# EAGLE design Shutdown Circuit (EAGLE 8.6.2)
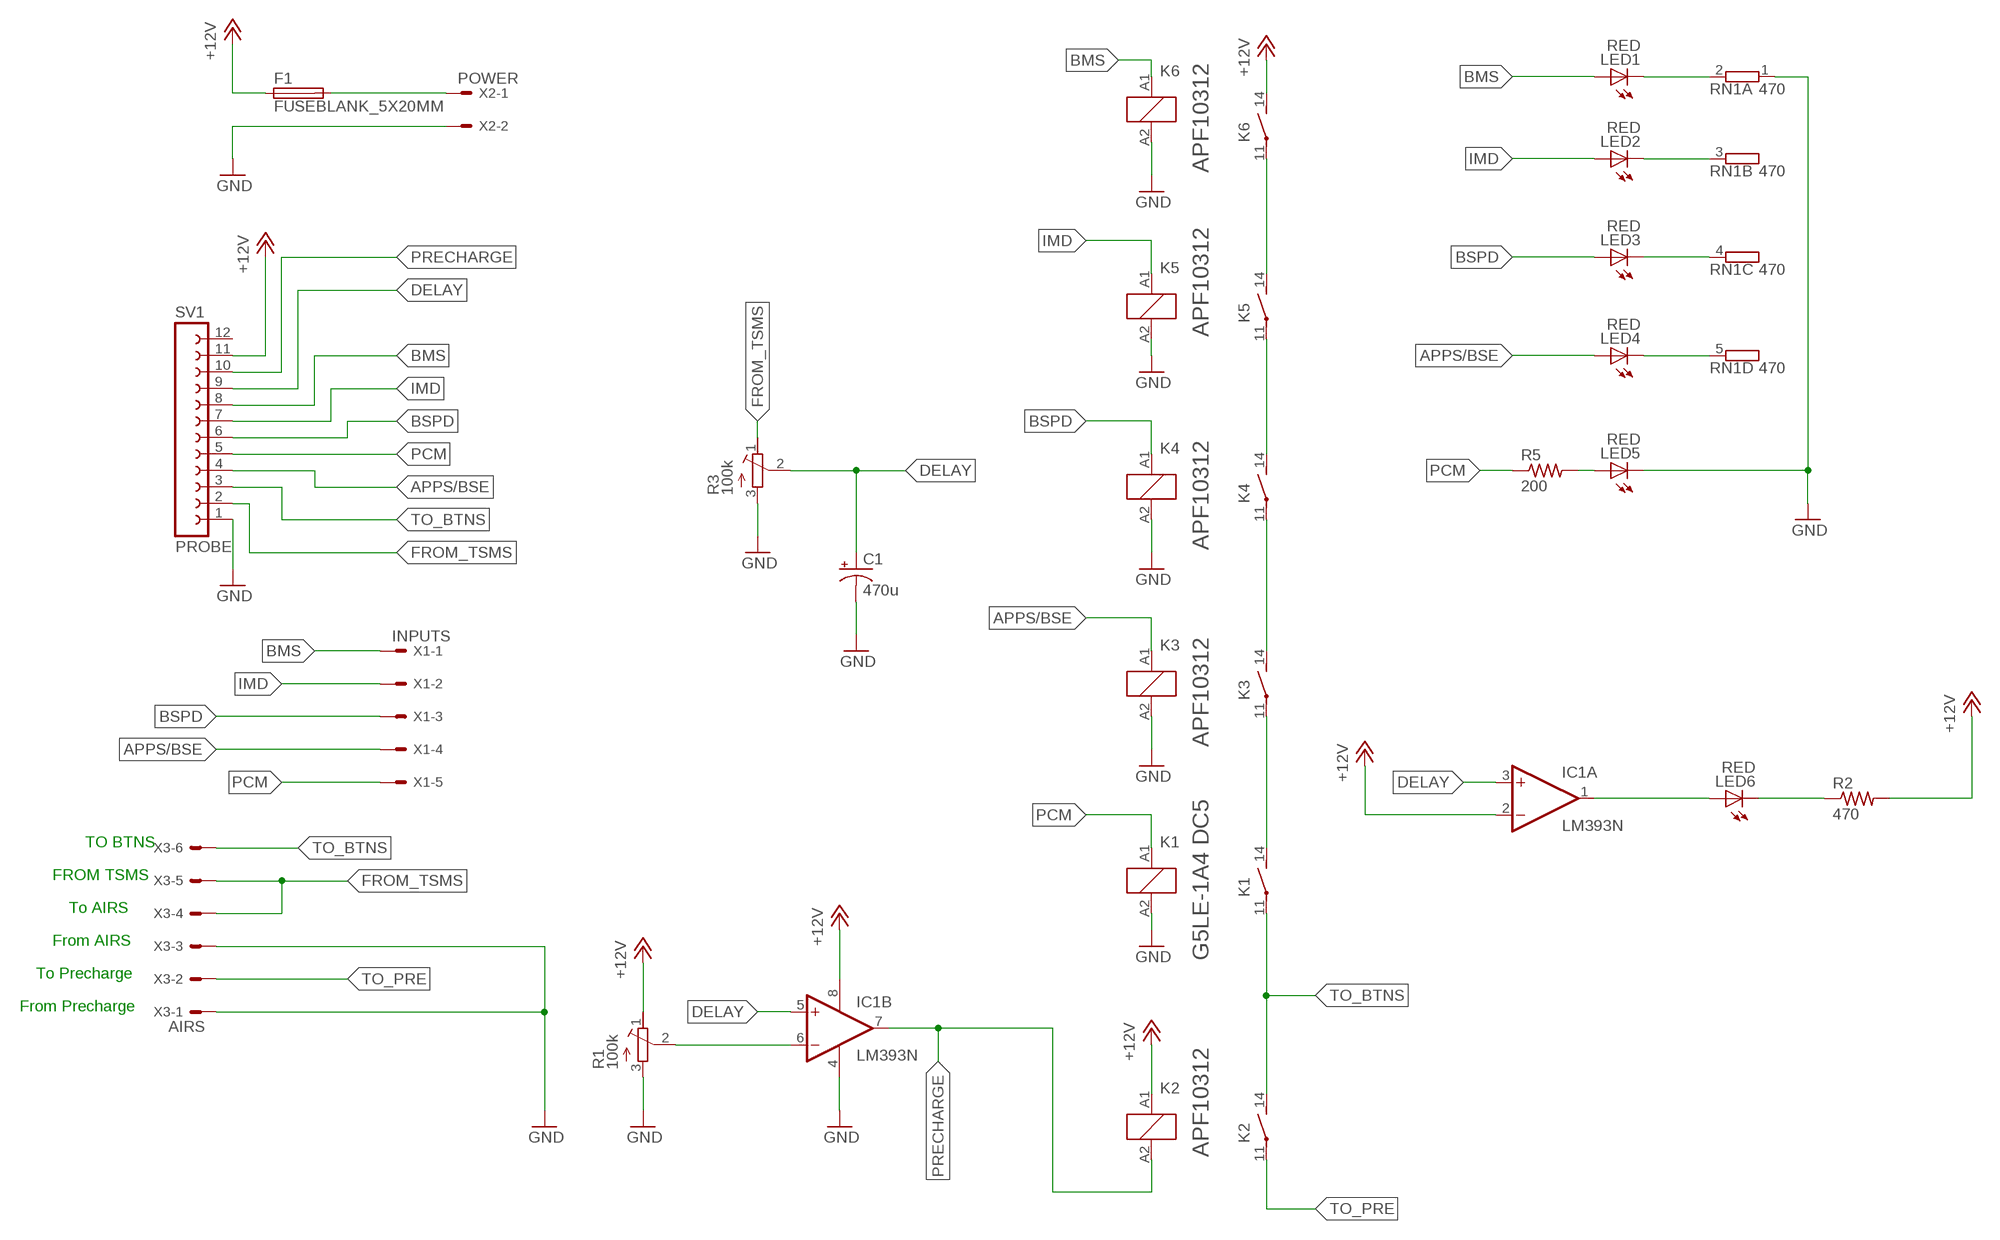
[diagram p0: schematic, sheet 1]

## Parts
C1  470u  CPOL-USE3.5-10  [E3,5-10]
F1  FUSEBLANK_5X20MM  [FUSE_HOLDER_5X20MM]
IC1  LM393N  [DIL08]
K1  G5LE-1A4 DC5  ZNS1106  [ZN1]
K2  APF10312  SNR1  [SNR-V1]
K3  APF10312  SNR1  [SNR-V1]
K4  APF10312  SNR1  [SNR-V1]
K5  APF10312  SNR1  [SNR-V1]
K6  APF10312  SNR1  [SNR-V1]
LED1  RED  LED5MM  [LED5MM]
LED2  RED  LED5MM  [LED5MM]
LED3  RED  LED5MM  [LED5MM]
LED4  RED  LED5MM  [LED5MM]
LED5  RED  LED5MM  [LED5MM]
LED6  RED  LED5MM  [LED5MM]
R1  100k  R-TRIMM3006P  [RTRIM3006P]
R2  470  R-US_0207/10  [0207/10]
R3  100k  R-TRIMM3006P  [RTRIM3006P]
R5  200  R-US_0207/10  [0207/10]
RN1  470  GE04R  [SIL5]
SV1  PROBE  FE12W  [FE12W]
X1  INPUTS  22-23-2051  [22-23-2051]
X2  POWER  22-23-2021  [22-23-2021]
X3  AIRS  22-23-2061  [22-23-2061]

## Nets
+12V: F1.1 IC1.2(A:-IN) IC1.8(P:V+) K2.A1 K6.14(2:S) R1.1(E) R2.2 SV1.11
APPS/BSE: K3.A1 LED4.A SV1.4 X1.4
BMS: K6.A1 LED1.A SV1.8 X1.1
BSPD: K4.A1 LED3.A SV1.6 X1.3
DELAY: C1.+ IC1.3(A:+IN) IC1.5(B:+IN) R3.2(S) SV1.9
FROM_TSMS: R3.1(E) SV1.2 X3.4 X3.5
GND: C1.- IC1.4(P:V-) K1.A2 K3.A2 K4.A2 K5.A2 K6.A2 LED5.K(C) R1.3(A) R3.3(A) RN1.1 SV1.1 X2.2 X3.1 X3.3
IMD: K5.A1 LED2.A SV1.7 X1.2
N$1: F1.2 X2.1
N$2: LED5.A R5.2
N$3: LED4.K(C) RN1.5
N$4: LED3.K(C) RN1.4
N$5: IC1.6(B:-IN) R1.2(S)
N$6: LED1.K(C) RN1.2
N$7: IC1.1(A:OUT) LED6.A
N$8: LED2.K(C) RN1.3
N$10: K5.14(2:S) K6.11(2:P)
N$13: LED6.K(C) R2.1
N$17: K4.14(2:S) K5.11(2:P)
N$18: K3.14(2:S) K4.11(2:P)
N$19: K1.14(2:S) K3.11(2:P)
PCM: K1.A1 R5.1 SV1.5 X1.5
PRECHARGE: IC1.7(B:OUT) K2.A2 SV1.10
TO_BTNS: K1.11(2:P) K2.14(2:S) SV1.3 X3.6
TO_PRE: K2.11(2:P) X3.2
Unconnected: SV1.12

## Notes on the sheet
- TO BTNS
- FROM TSMS
- To AIRS
- From AIRS
- To Precharge
- From Precharge

## Library data of the parts
C1 = rcl:CPOL-US: POLARIZED CAPACITOR, American symbol; SPICEPREFIX: C
F1 = fuse:FUSE: Fuse; OC_FARNELL: unknown; OC_NEWARK: unknown
IC1 = linear:LM393: COMPARATOR
K1 = relay:ZNS1*: Miniature Power PCB Relay SCHRACK 1pole 10 A Source: http://www.schrack.com/.. 5847.pdf; OC_FARNELL: unknown; OC_NEWARK: unknown
K2-K6 = relay:SN*: Slim PCB Relay 1 pole 6 A SCHRACK Source: http://www.schrack.com/.. 5815.pdf; OC_FARNELL: unknown; OC_NEWARK: unknown
LED1-LED6 = led:LED: LED OSRAM: - CHIPLED LG R971, LG N971, LY N971, LG Q971, LY Q971, LO R971, LY R971 LH N974, LH R974 LS Q976, LO Q976, LY Q976 LO Q996 - Hyper CHIPLED LW Q18S LB Q993, LB Q99A, LB R99A - SideLED LS A670, LO A670, LY A670, LG A670, LP A670 LB A673, LV A673, LT A673, LW A673 LH A674 LY A675 LS A676, LA A676, LO A676, LY A676, LW A676 LS A679, LY A679, LG A679 - Hyper Micro SIDELED® LS Y876, LA Y876, LO Y876, LY Y876 LT Y87S - SmartLED LW L88C, LW L88S LB L89C, LB L89S, LG L890 LS L89K, LO L89K, LY L89K LS L896, LA L896, LO L896, LY L896 - TOPLED LS T670, LO T670, LY T670, LG T670, LP T670 LSG T670, LSP T670, LSY T670, LOP T670, LYG T670 LG T671, LOG T671, LSG T671 LB T673, LV T673, LT T673, LW T673 LH T674 LS T676, LA T676, LO T676, LY T676, LB T676, LH T676, LSB T676, LW T676 LB T67C, LV T67C, LT T67C, LS T67K, LO T67K, LY T67K, LW E67C LS E67B, LA E67B, LO E67B, LY E67B, LB E67C, LV E67C, LT E67C LW T67C LS T679, LY T679, LG T679 LS T770, LO T770, LY T770, LG T770, LP T770 LB T773, LV T773, LT T773, LW T773 LH T774 LS E675, LA E675, LY E675, LS T675 LS T776, LA T776, LO T776, LY T776, LB T776 LHGB T686 LT T68C, LB T68C - Hyper Mini TOPLED® LB M676 - Mini TOPLED Santana® LG M470 LS M47K, LO M47K, LY M47K Source: http://www.osram.convergy.de LUXEON: - LUMILED® LXK2-PW12-R00, LXK2-PW12-S00, LXK2-PW14-U00, LXK2-PW14-V00 LXK2-PM12-R00, LXK2-PM12-S00, LXK2-PM14-U00 LXK2-PE12-Q00, LXK2-PE12-R00, LXK2-PE12-S00, LXK2-PE14-T00, LXK2-PE14-U00 LXK2-PB12-K00, LXK2-PB12-L00, LXK2-PB12-M00, LXK2-PB14-N00, LXK2-PB14-P00, LXK2-PB14-Q00 LXK2-PR12-L00, LXK2-PR12-M00, LXK2-PR14-Q00, LXK2-PR14-R00 LXK2-PD12-Q00, LXK2-PD12-R00, LXK2-PD12-S00 LXK2-PH12-R00, LXK2-PH12-S00 LXK2-PL12-P00, LXK2-PL12-Q00, LXK2-PL12-R00 Source: www.luxeon.com KINGBRIGHT: KA-3528ASYC Source: www.kingbright.com
R1 R3 = rcl:R-TRIMM: Trimm resistor; SPICEMODEL: X; SPICEPREFIXL: POT
R2 R5 = rcl:R-US_: RESISTOR, American symbol; SPICEPREFIX: R
RN1 = resistor-sil:GE04R: SIL RESISTOR; OC_FARNELL: unknown; OC_NEWARK: unknown
SV1 = con-lsta:FE12W: FEMALE HEADER; OC_FARNELL: unknown; OC_NEWARK: unknown
X1 = con-molex:22-23-2051: .100" (2.54mm) Center Header - 5 Pin; MF: MOLEX; MPN: 22-23-2051; OC_FARNELL: 1462952; OC_NEWARK: 38C9178
X2 = con-molex:22-23-2021: .100" (2.54mm) Center Header - 2 Pin; MF: MOLEX; MPN: 22-23-2021; OC_FARNELL: 1462926; OC_NEWARK: 25C3832
X3 = con-molex:22-23-2061: .100" (2.54mm) Center Header - 6 Pin; MF: MOLEX; MPN: 22-23-2061; OC_FARNELL: 1462922; OC_NEWARK: 27C1933

## Board
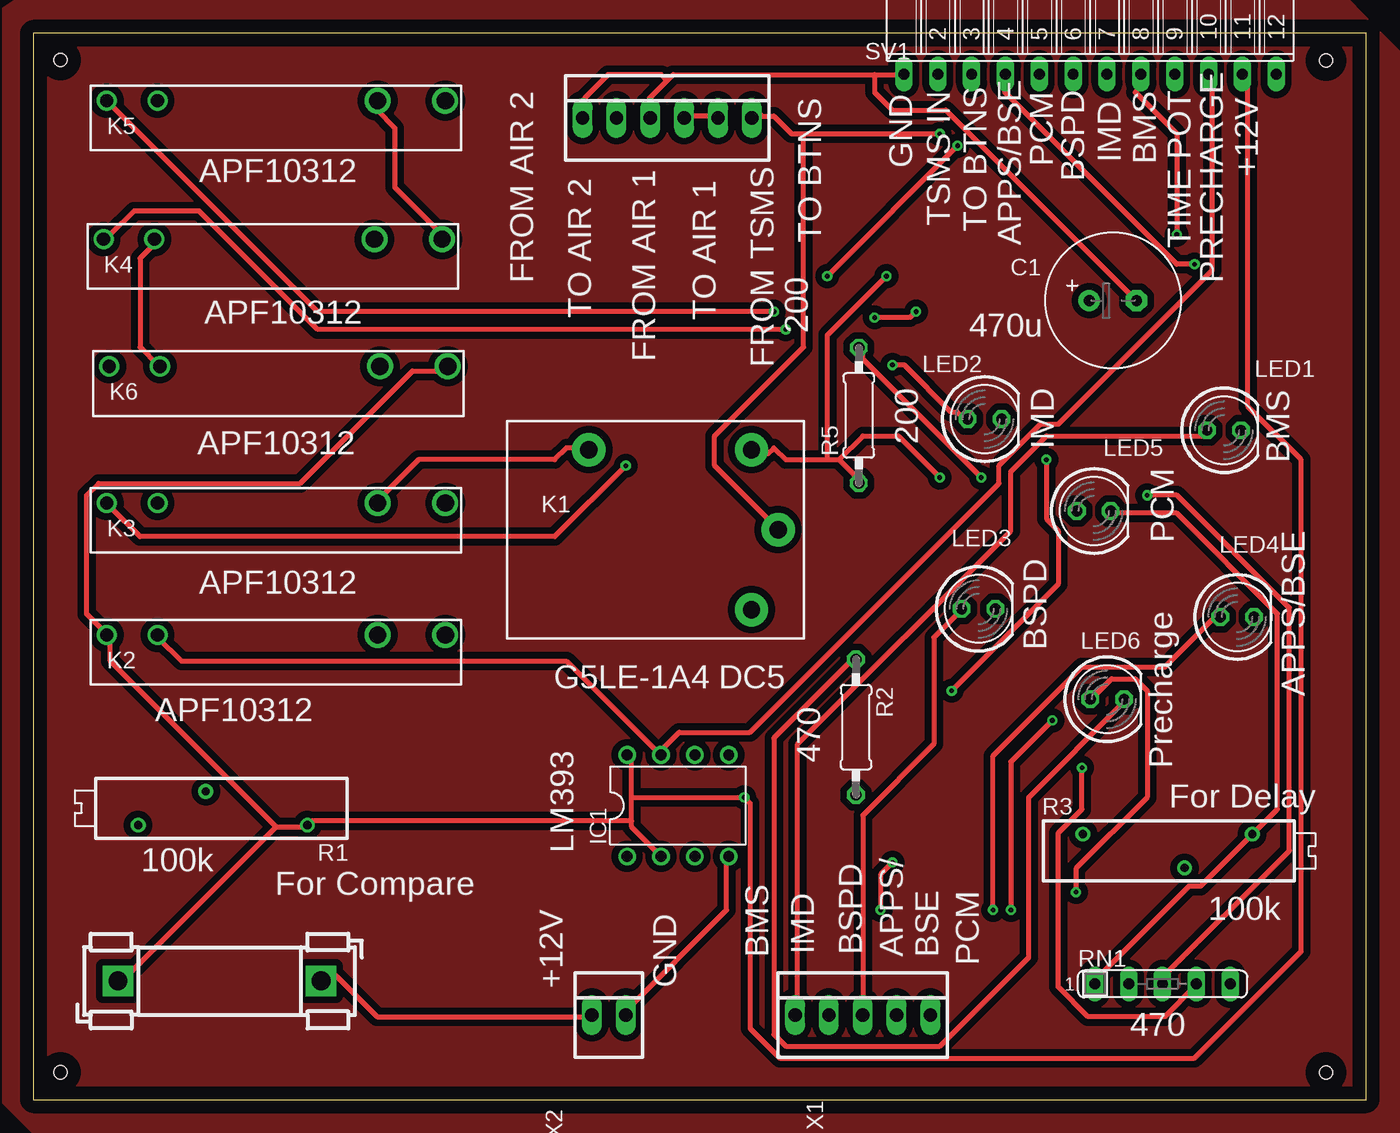
[diagram p1: board, top side]
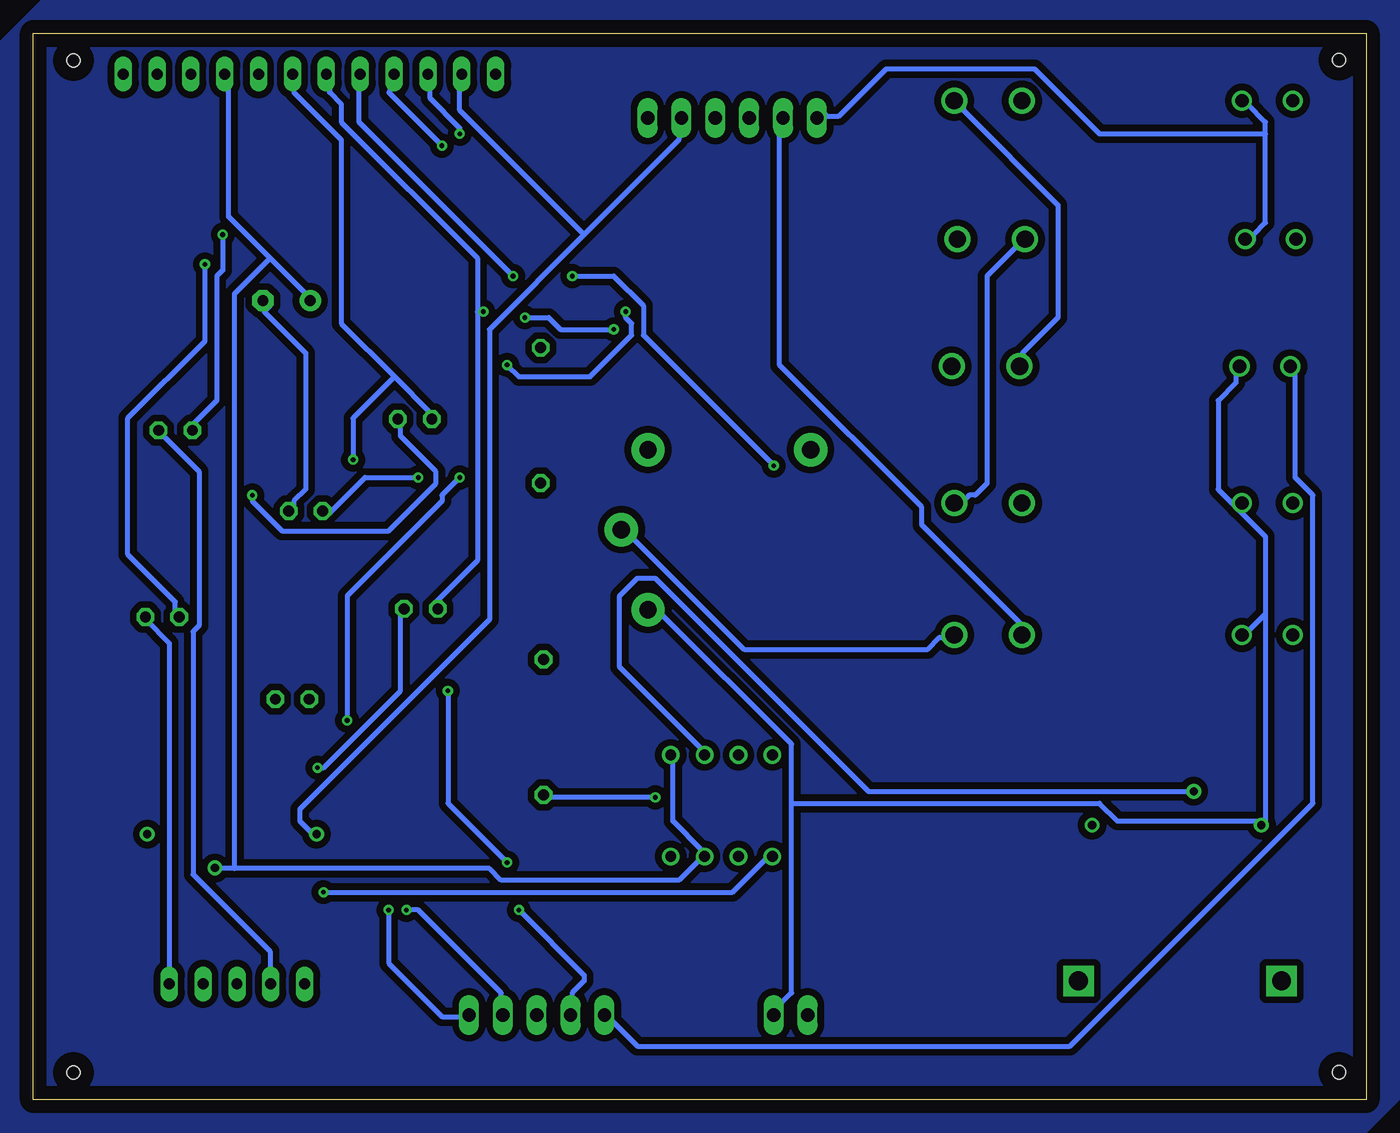
[diagram p2: board, bottom side, seen from below]

Size 100 x 80 mm. Coordinates in mm from the lower left corner, seen from the top.
Outline: 0,0 100,0 100,80 0,80 0,0
Copper layers (1*16): Top 0.035mm / dielectric 1.5mm / Bottom 0.035mm
Design rules "default *": minimum track width 15mil, minimum drill 0.35mm, track to track 20mil, track to pad 20mil, pad to pad 20mil, via to via 20mil, smd to smd 6mil, copper to edge 40mil, drill to drill 6mil, minimum pad ring 10mil, minimum via ring 8mil, stop-mask expansion 4mil, vias tented up to drill 0mil, thermal gap 10mil
Holes 1 mm at 2.04,77.99 96.98,77.97 2.04,2.04 96.98,2.03

### Footprints (pad centres in the part's own frame; a part is rotated, then mirrored left to right if it is on the bottom)
E3,5-10 = drill 0.813 pad 1.6: + -1.778,0 | drill 0.813 pad 1.6 octagon: - 1.778,0
FUSE_HOLDER_5X20MM = drill 1.422 pad 2.286 square: 1 0,0; 2 15.24,0
DIL08 = drill 0.813 pad 1.27: 1 -3.81,-3.81; 2 -1.27,-3.81; 3 1.27,-3.81; 4 3.81,-3.81; 5 3.81,3.81; 6 1.27,3.81; 7 -1.27,3.81; 8 -3.81,3.81
ZN1 = drill 1.3 pad 2.5: 11 8.89,0; 14 -5.31,6; A1 6.89,6; A2 6.89,-6
SNR-V1 = drill 1.3: 11 7.62,1.27; 14 12.7,1.27 | drill 1: A1 -12.7,1.27; A2 -8.89,1.27
LED5MM = drill 0.813 octagon: A -1.27,0; K 1.27,0
RTRIM3006P = drill 0.61: 1 -7.62,1.27; 2 0,-1.27; 3 5.08,1.27
0207/10 = drill 0.813 octagon: 1 -5.08,0; 2 5.08,0
SIL5 = drill 0.813 long: 1 -5.08,0; 2 -2.54,0; 3 0,0; 4 2.54,0; 5 5.08,0
FE12W = drill 0.813 long: 1 -13.97,0; 2 -11.43,0; 3 -8.89,0; 4 -6.35,0; 5 -3.81,0; 6 -1.27,0; 7 1.27,0; 8 3.81,0; 9 6.35,0; 10 8.89,0; 11 11.43,0; 12 13.97,0
22-23-2051 = drill 1 long: 1 -5.08,0; 2 -2.54,0; 3 0,0; 4 2.54,0; 5 5.08,0
22-23-2021 = drill 1 long: 1 -1.27,0; 2 1.27,0
22-23-2061 = drill 1 long: 1 -6.35,0; 2 -3.81,0; 3 -1.27,0; 4 1.27,0; 5 3.81,0; 6 6.35,0

### Placement (x,y rotation side)
C1  81,59.94 0 top
F1  6.35,8.89 0 top
IC1  48.36,22.05 0 top
K1  46.99,42.76 0 top
K2  18.21,33.59 0 top
K3  18.21,43.48 0 top
K4  17.97,63.28 0 top
K5  18.21,73.67 0 top
K6  18.39,53.75 0 top
LED1  89.33,50.22 0 top
LED2  71.37,51.05 0 top
LED3  70.92,36.82 0 top
LED4  90.32,36.21 0 top
LED5  79.57,44.16 0 top
LED6  80.57,30.04 0 top
R1  12.94,21.86 180 top
R2  61.72,27.94 270 top
R3  86.37,18.64 0 top
R5  61.94,51.33 90 top
RN1  84.72,8.67 0 top
SV1  79.29,76.94 0 top
X1  62.23,6.35 0 top
X2  43.18,6.35 0 top
X3  47.56,73.66 0 top

### Tracks (layer width: path | path; a pad name or v marks a point on that pad's centre or on a via)
+12V  (via drill 0.35)
  Top 0.381: 18.22,20.45 20.45,20.45 R1.1 20.89,20.89 44.9,20.89 | 18.22,20.45 6.67,8.89 F1.1 | 18.22,20.45 5.78,32.89 5.78,34.67 K2.A1 5.33,35.12 4,36.45 4,45.34 4.89,46.23 20,46.23 28.45,54.67 30.67,54.67 K6.14 | 44.9,20.89 44.9,20.45 46.67,18.67 IC1.2 | 44.9,20.89 44.9,22.67 | 44.9,22.67 44.9,25.78 IC1.8 | 44.9,22.67 v53.34,22.67 53.78,22.23 53.78,5.33 56.01,3.11 87.12,3.11 95.12,11.11 95.12,48.01 91.12,52.01 91.12,76.9 SV1.11
  Bottom 0.381: v53.34,22.67 61.34,22.67 R2.2
APPS/BSE  (via drill 0.35)
  Top 0.381: v72.01,14.22 72.01,25.78 78.68,32.45 84.9,32.45 88.46,36.01 88.9,36.01 LED4.A | v87.12,62.67 85.79,62.67 72.9,75.56 72.9,76.9 SV1.4 | v44.45,47.56 39.12,42.23 8,42.23 5.78,44.45 K3.A1 | v69.34,71.56 v59.56,61.78
  Bottom 0.381: v72.01,14.22 71.12,14.22 64.9,8 64.9,6.67 X1.4 | v87.12,62.67 87.12,56.9 92.9,51.12 92.9,40.89 89.34,37.34 89.34,36.45 LED4.A | v44.45,47.56 54.23,57.34 54.23,59.56 56.45,61.78 v59.56,61.78 | v69.34,71.56 73.34,75.56 72.9,76.01 72.9,76.9 SV1.4
BMS  (via drill 0.35)
  Top 0.381: v85.79,64.9 85.79,72.45 82.68,75.56 83.12,76.01 83.12,76.9 SV1.8 | LED1.A 88.01,49.78 76.01,49.78 73.34,47.12 73.34,42.67 57.34,26.67 57.34,6.67 X1.1
  Bottom 0.381: v85.79,64.9 85.79,62.23 86.23,61.78 86.23,52.45 88.01,50.67 88.01,50.23 LED1.A | K6.A1 5.33,54.67 5.33,46.67 4,45.34 4,22.23 22.23,4 54.67,4 56.9,6.22 X1.1
BSPD  (via drill 0.35)
  Top 0.381: v56.45,57.78 21.34,57.78 12.45,66.67 7.56,66.67 5.78,64.9 5.33,64.9 K4.A1 | v63.12,58.67 65.79,58.67 v66.23,59.12 | X1.3 62.23,21.34 67.56,26.67 67.56,34.67 69.34,36.45 LED3.A
  Bottom 0.381: 66.67,59.12 66.67,63.12 76.9,73.34 76.9,74.68 77.79,75.56 77.79,76.9 SV1.6 | 66.67,59.12 66.67,40.45 69.79,37.34 69.79,36.89 LED3.A | v56.45,57.78 60.45,57.78 61.34,58.67 v63.12,58.67 | 66.67,59.12 v66.23,59.12
DELAY
  Bottom 0.381: 82.23,63.12 79.12,60.01 C1.+ | 82.23,63.12 85.34,66.23 85.34,76.9 SV1.9 | 84.9,17.34 65.79,17.34 64.9,16.45 51.56,16.45 49.78,18.22 IC1.3 49.78,18.67 52.01,20.89 52.01,25.78 IC1.5 | 84.9,17.34 86.23,17.34 R3.2 | 82.23,63.12 84.9,60.45 84.9,17.34
FROM_TSMS
  Top 0.381: X3.4 48.9,73.79 51.12,73.79 X3.5
  Bottom 0.381: 58.67,64.9 51.56,72.01 51.56,73.34 X3.5 | 58.67,64.9 65.79,57.78 65.79,36.01 80.01,21.78 80.01,20.89 79.12,20 R3.1 | 58.67,64.9 68.01,74.23 68.01,76.9 SV1.2
GND
  Top 0.381: K6.A2 9.34,55.12 8,56.45 8,63.12 9.34,64.45 K4.A2 | 63.12,76.9 48.01,76.9 47.56,76.45 | 63.12,76.9 64.9,76.9 SV1.1 | 47.56,76.45 46.23,75.12 46.23,73.79 X3.3 | 47.56,76.45 47.12,76.9 43.12,76.9 41.34,75.12 41.34,73.79 X3.1 | 63.12,76.9 63.12,75.56 64.45,74.23 68.45,74.23 82.68,60.01 C1.- | IC1.4 52.01,18.22 52.01,14.22 44.45,6.67 X2.2 | LED5.K 80.9,44.01 85.79,44.01 93.34,36.45 93.34,21.78 91.57,20 R3.3 91.12,19.56 87.57,16 86.68,16 80.01,9.34 80.01,8.89 RN1.1
  Bottom 0.381: 7.56,36.45 8.89,35.12 | 7.56,36.45 7.56,42.23 9.78,44.45 | 9.78,44.45 9.34,44.9 K3.A2 9.78,44.45 | 7.56,72.45 7.56,65.79 8.45,64.9 8.45,64.45 8.89,64.01 9.34,64.45 K4.A2 | 7.56,72.45 7.56,73.34 8.89,74.68 K5.A2 | 9.78,44.45 11.11,45.78 11.11,52.45 9.78,53.78 9.78,54.67 K6.A2 | LED5.K 80.45,44.45 80.45,44.9 79.57,45.78 79.57,56.01 82.68,59.12 82.23,59.56 82.23,60.01 82.68,60.01 C1.- | 7.56,72.45 20,72.45 24.89,77.34 36.01,77.34 39.56,73.79 40.45,73.79 40.89,74.23 41.34,73.79 X3.1 | 43.12,22.23 43.12,8 44.45,6.67 X2.2 | 43.12,22.23 43.12,26.67 52.9,36.45 53.78,36.45 K1.A2 | 7.56,36.45 7.56,20.89 R1.3 8,20.89 18.67,20.89 20,22.23 43.12,22.23
IMD  (via drill 0.35)
  Top 0.381: v63.56,14.22 63.56,16.89 v64.45,17.78 | v68.9,30.67 76.9,38.67 76.9,42.67 76.01,43.56 v76.01,48.01 | K5.A1 21.34,59.12 v55.56,59.12 | v64.45,55.12 65.34,55.12 68.9,51.56 69.34,51.56 69.79,51.12 LED2.A
  Bottom 0.381: 72.9,54.23 76.9,58.23 76.9,72.01 80.45,75.56 80.45,76.9 SV1.7 | 72.9,54.23 70.23,51.56 70.23,51.12 LED2.A | v63.56,14.22 58.67,9.34 58.67,8.89 59.56,8 59.56,6.67 X1.2 | v64.45,17.78 68.9,22.23 v68.9,30.67 | v76.01,48.01 76.01,51.12 72.9,54.23 | v55.56,59.12 55.56,58.67 55.12,58.23 55.12,57.34 58.23,54.23 63.56,54.23 v64.45,55.12
N$1
  Top 0.381: X2.1 41.78,6.22 25.78,6.22 22.67,9.34 22.23,9.34 21.78,8.89 F1.2
N$2  (via drill 0.35)
  Top 0.381: v71.12,46.67 62.23,55.56 62.23,56.01 R5.2
  Bottom 0.381: v71.12,46.67 75.12,46.67 77.79,44.01 78.23,44.01 LED5.A
N$3
  Bottom 0.381: RN1.5 89.79,8.89 89.79,34.23 91.57,36.01 LED4.K
N$4  (via drill 0.35)
  Top 0.381: v78.68,24.89 78.68,21.78 76.9,20 76.9,8.45 79.12,6.22 84.9,6.22 87.12,8.45 RN1.4
  Bottom 0.381: v78.68,24.89 78.23,24.89 72.45,30.67 72.45,36.45 LED3.K
N$5
  Bottom 0.381: R1.2 13.34,23.11 37.34,23.11 53.34,39.12 54.67,39.12 56.01,37.78 56.01,32.45 49.78,26.23 IC1.6
N$6
  Bottom 0.381: RN1.2 82.23,8.89 82.23,11.11 88.01,16.89 88.01,35.12 87.57,35.56 87.57,47.12 90.23,49.78 LED1.K
N$7  (via drill 0.35)
  Top 0.381: v78.23,15.56 78.23,17.34 83.57,22.67 83.57,30.67 82.68,31.56 80.9,31.56 79.57,30.23 LED6.A
  Bottom 0.381: v78.23,15.56 47.56,15.56 44.9,18.22 IC1.1
N$8  (via drill 0.35)
  Top 0.381: v83.57,45.34 85.79,45.34 94.23,36.89 94.23,18.67 84.45,8.89 RN1.3
  Bottom 0.381: v83.57,45.34 83.57,44.9 81.34,42.67 73.34,42.67 69.79,46.23 69.79,47.12 72.45,49.78 72.45,50.67 LED2.K
N$9
  pour Top: -2.29,-0.24 0.6,-3.12 103.33,-3.12 103.45,-3.25 103.45,77.64 98.35,82.89 -0.77,82.89 -2.29,81.84 -2.3,81.85
N$10
  Bottom 0.381: K6.11 25.78,55.12 25.78,56.01 23.11,58.67 23.11,67.12 30.23,74.23 30.23,74.68 30.67,75.12 K5.14
N$11
  pour Bottom: -4.76,2.31 0.86,-3.31 103.24,-3.31 103.38,-3.17 103.38,77.67 103.81,78.11 99.05,82.87 94.73,82.87 -4.32,82.87 -4.9,83.3
N$13
  Top 0.381: LED6.K 81.79,29.78 74.68,22.67 74.68,10.67 68.01,4 56.45,4 55.56,4.89 55.56,27.11 61.34,32.89 R2.1
N$17
  Top 0.381: K4.14 30.67,64.9 27.11,68.45 27.11,72.9 25.78,74.23 25.78,74.68 K5.11
N$18
  Bottom 0.381: K3.14 30.67,44.9 30.23,44.9 29.78,45.34 29.34,45.34 28.45,46.23 28.45,61.78 26.23,64.01 25.78,64.01 25.34,64.45 K4.11
N$19
  Top 0.381: K3.11 26.23,44.9 26.23,45.34 28.89,48.01 39.12,48.01 40.01,48.9 41.34,48.9 K1.14
PCM  (via drill 0.35)
  Top 0.381: 60.45,48.01 61.78,46.67 R5.1 | 59.56,48.01 56.45,48.01 55.56,48.9 55.12,48.45 54.23,48.45 K1.A1 | 59.56,48.01 60.45,48.01 | v64.01,61.78 59.56,57.34 59.56,48.01 | v73.34,14.22 73.34,25.34 v76.45,28.45 | v68.01,46.67 64.9,49.78 62.23,49.78 60.45,48.01
  Bottom 0.381: v64.01,61.78 75.56,73.34 75.56,76.9 SV1.5 | v73.34,14.22 73.34,10.22 69.34,6.22 67.56,6.22 X1.5 | v76.45,28.45 76.45,37.78 69.34,44.9 69.34,45.34 v68.01,46.67
PRECHARGE
  Top 0.381: K2.A2 9.34,34.67 11.11,32.89 40.01,32.89 46.67,26.23 IC1.7 47.12,26.23 48.45,27.56 53.78,27.56 72.45,46.23 72.45,47.56 75.56,50.67 76.9,50.67 88.46,62.23 88.46,76.9 SV1.10
TO_BTNS  (via drill 0.35)
  Top 0.381: 57.78,72.45 56.9,72.45 55.56,73.79 54.67,73.79 54.23,74.23 53.78,73.79 X3.6 | 57.78,72.45 v68.01,72.45 | 57.78,72.45 57.78,56.45 51.12,49.78 51.12,47.56 55.12,43.56 55.56,43.56 56.01,43.12 K1.11
  Bottom 0.381: v68.01,72.45 68.01,72.9 70.23,75.12 70.23,76.9 SV1.3 | K2.14 31.11,34.67 32,34.67 32.89,33.78 46.67,33.78 55.56,42.67 K1.11
TO_PRE
  Bottom 0.381: X3.2 44.01,73.34 44.01,55.12 33.34,44.45 33.34,43.12 25.78,35.56 25.78,35.12 K2.11

### Text on the board
tNames: GND | PCM | IMD | BMS | APF10312 | BSPD | +12V | TSMS IN | TO BTNS | TO BTNS | APPS/BSE | TIME POT | FROM AIR 2 | PRECHARGE | TO AIR 2 | TO AIR 1 | APF10312 | 200 | 470u | FROM AIR 1 | FROM TSMS | 200 | IMD | APF10312 | BMS | PCM | APF10312 | BSPD | G5LE-1A4 DC5 | APPS/BSE | APF10312 | 470 | Precharge | For Delay | LM393 | 100k | For Compare | 100k | BMS | IMD | BSPD | APPS/ / BSE | PCM | +12V | GND | 470